# EAGLE design regulator_plus_switch (EAGLE 7.2.0)
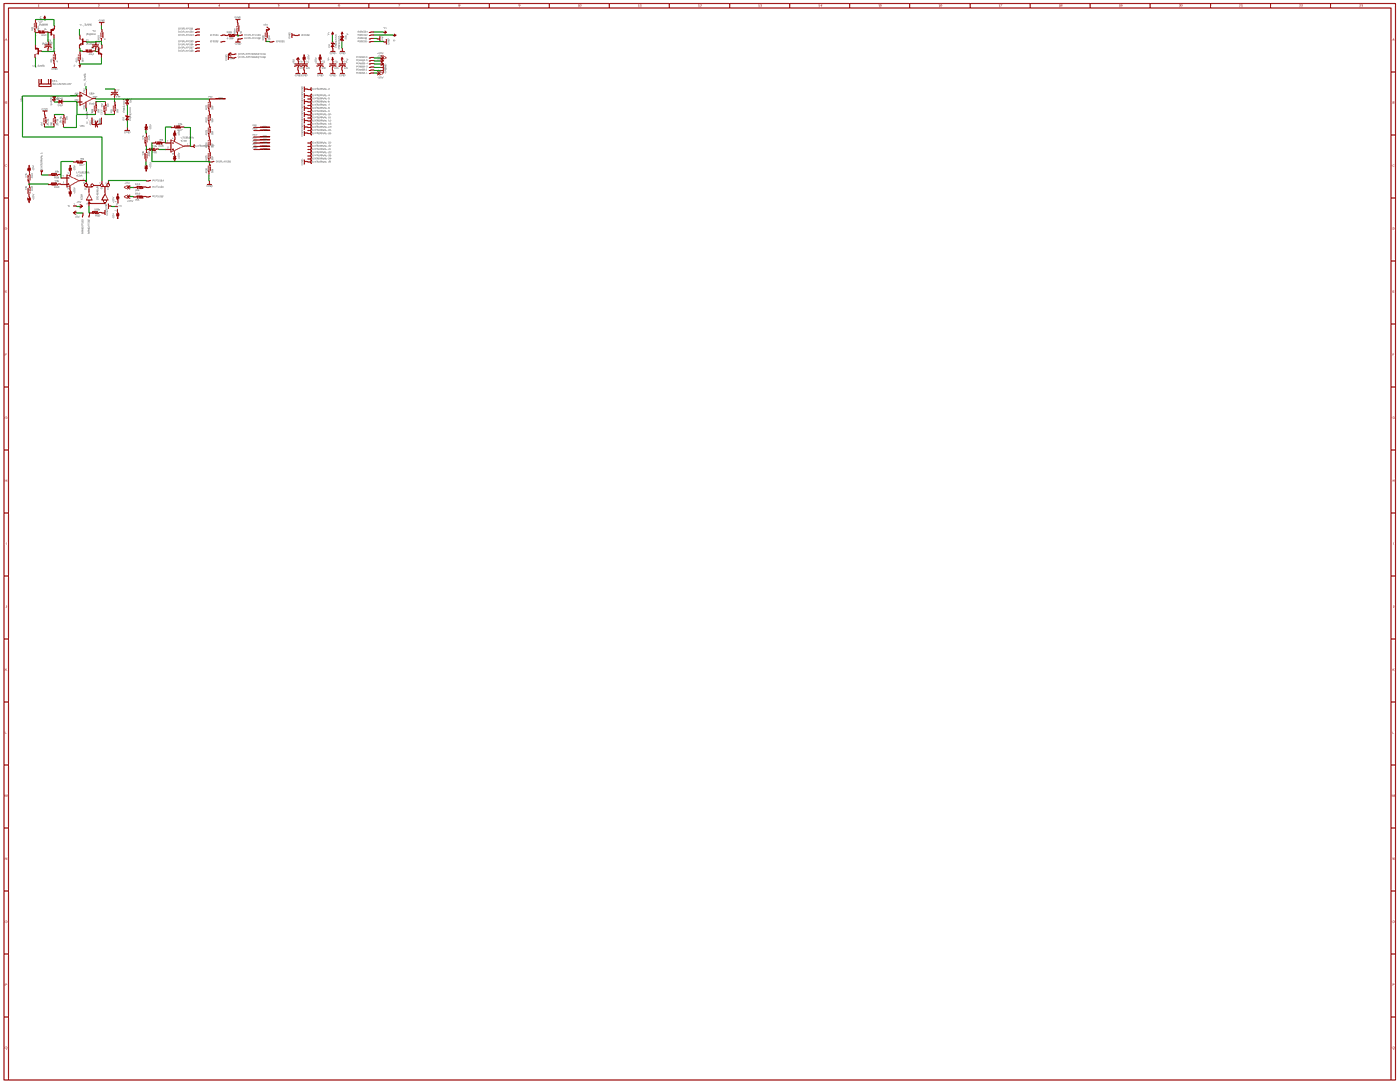
[diagram p0: schematic, sheet 1, overview]
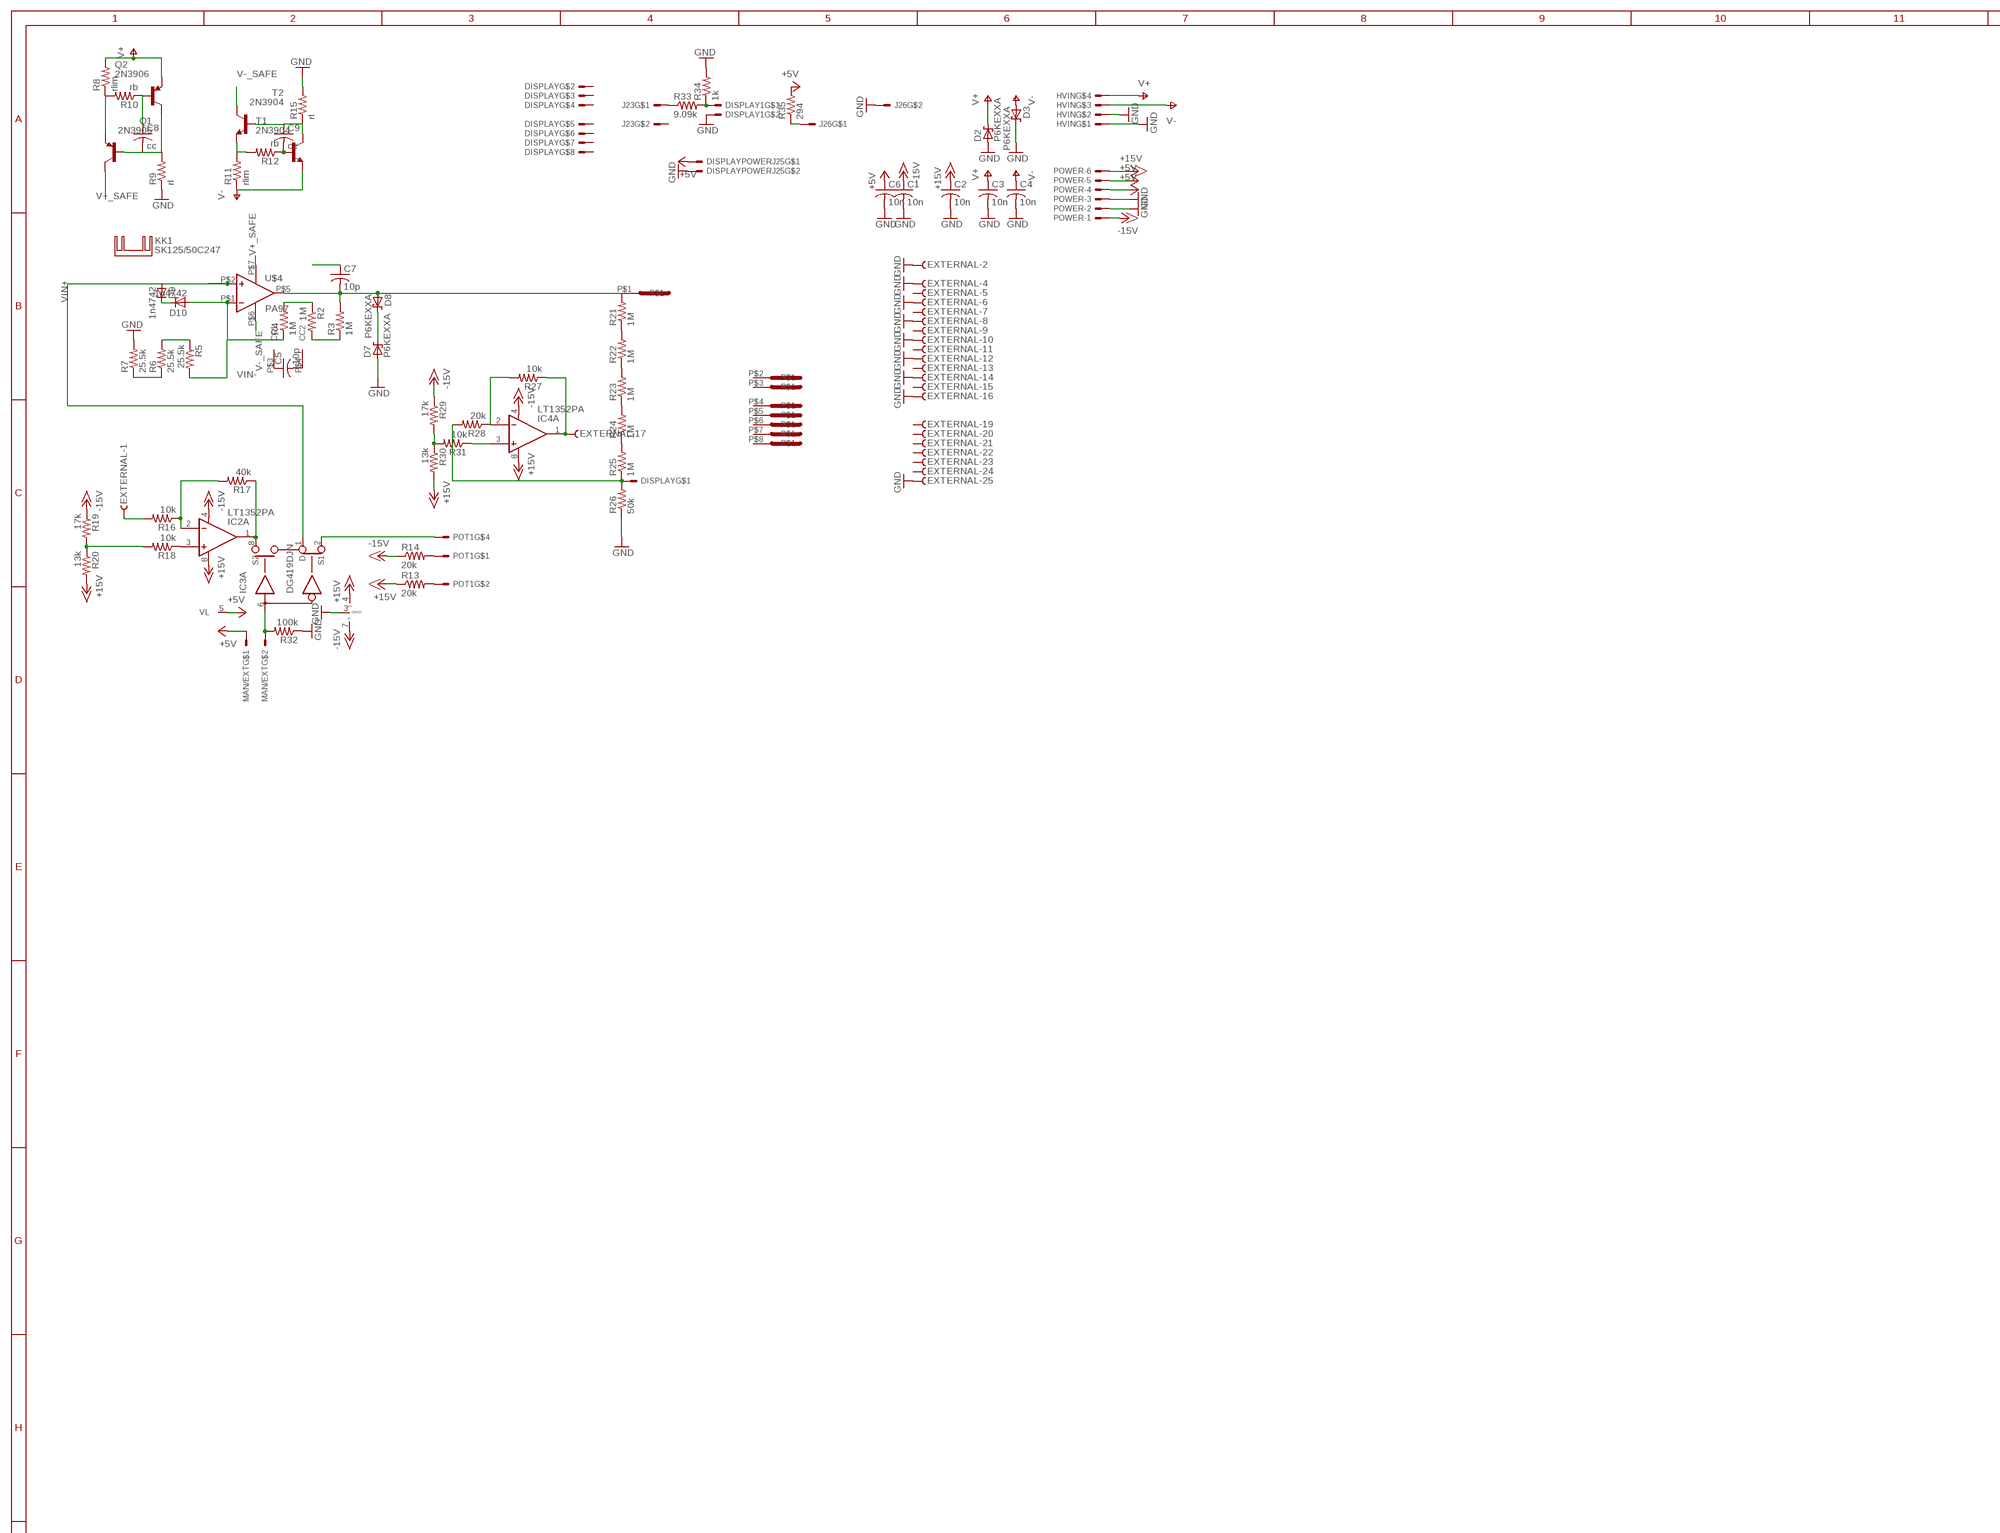
[diagram p1: schematic, sheet 1, part 1 of 5]
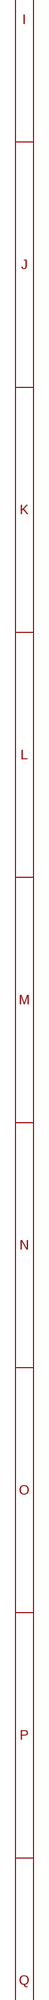
[diagram p2: schematic, sheet 1, part 2 of 5]
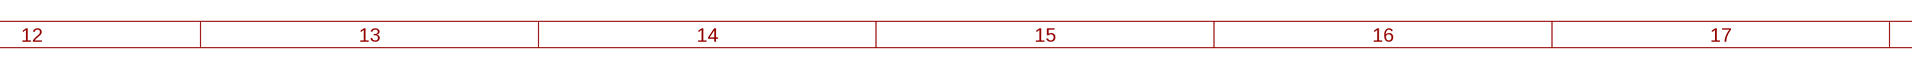
[diagram p3: schematic, sheet 1, part 3 of 5]
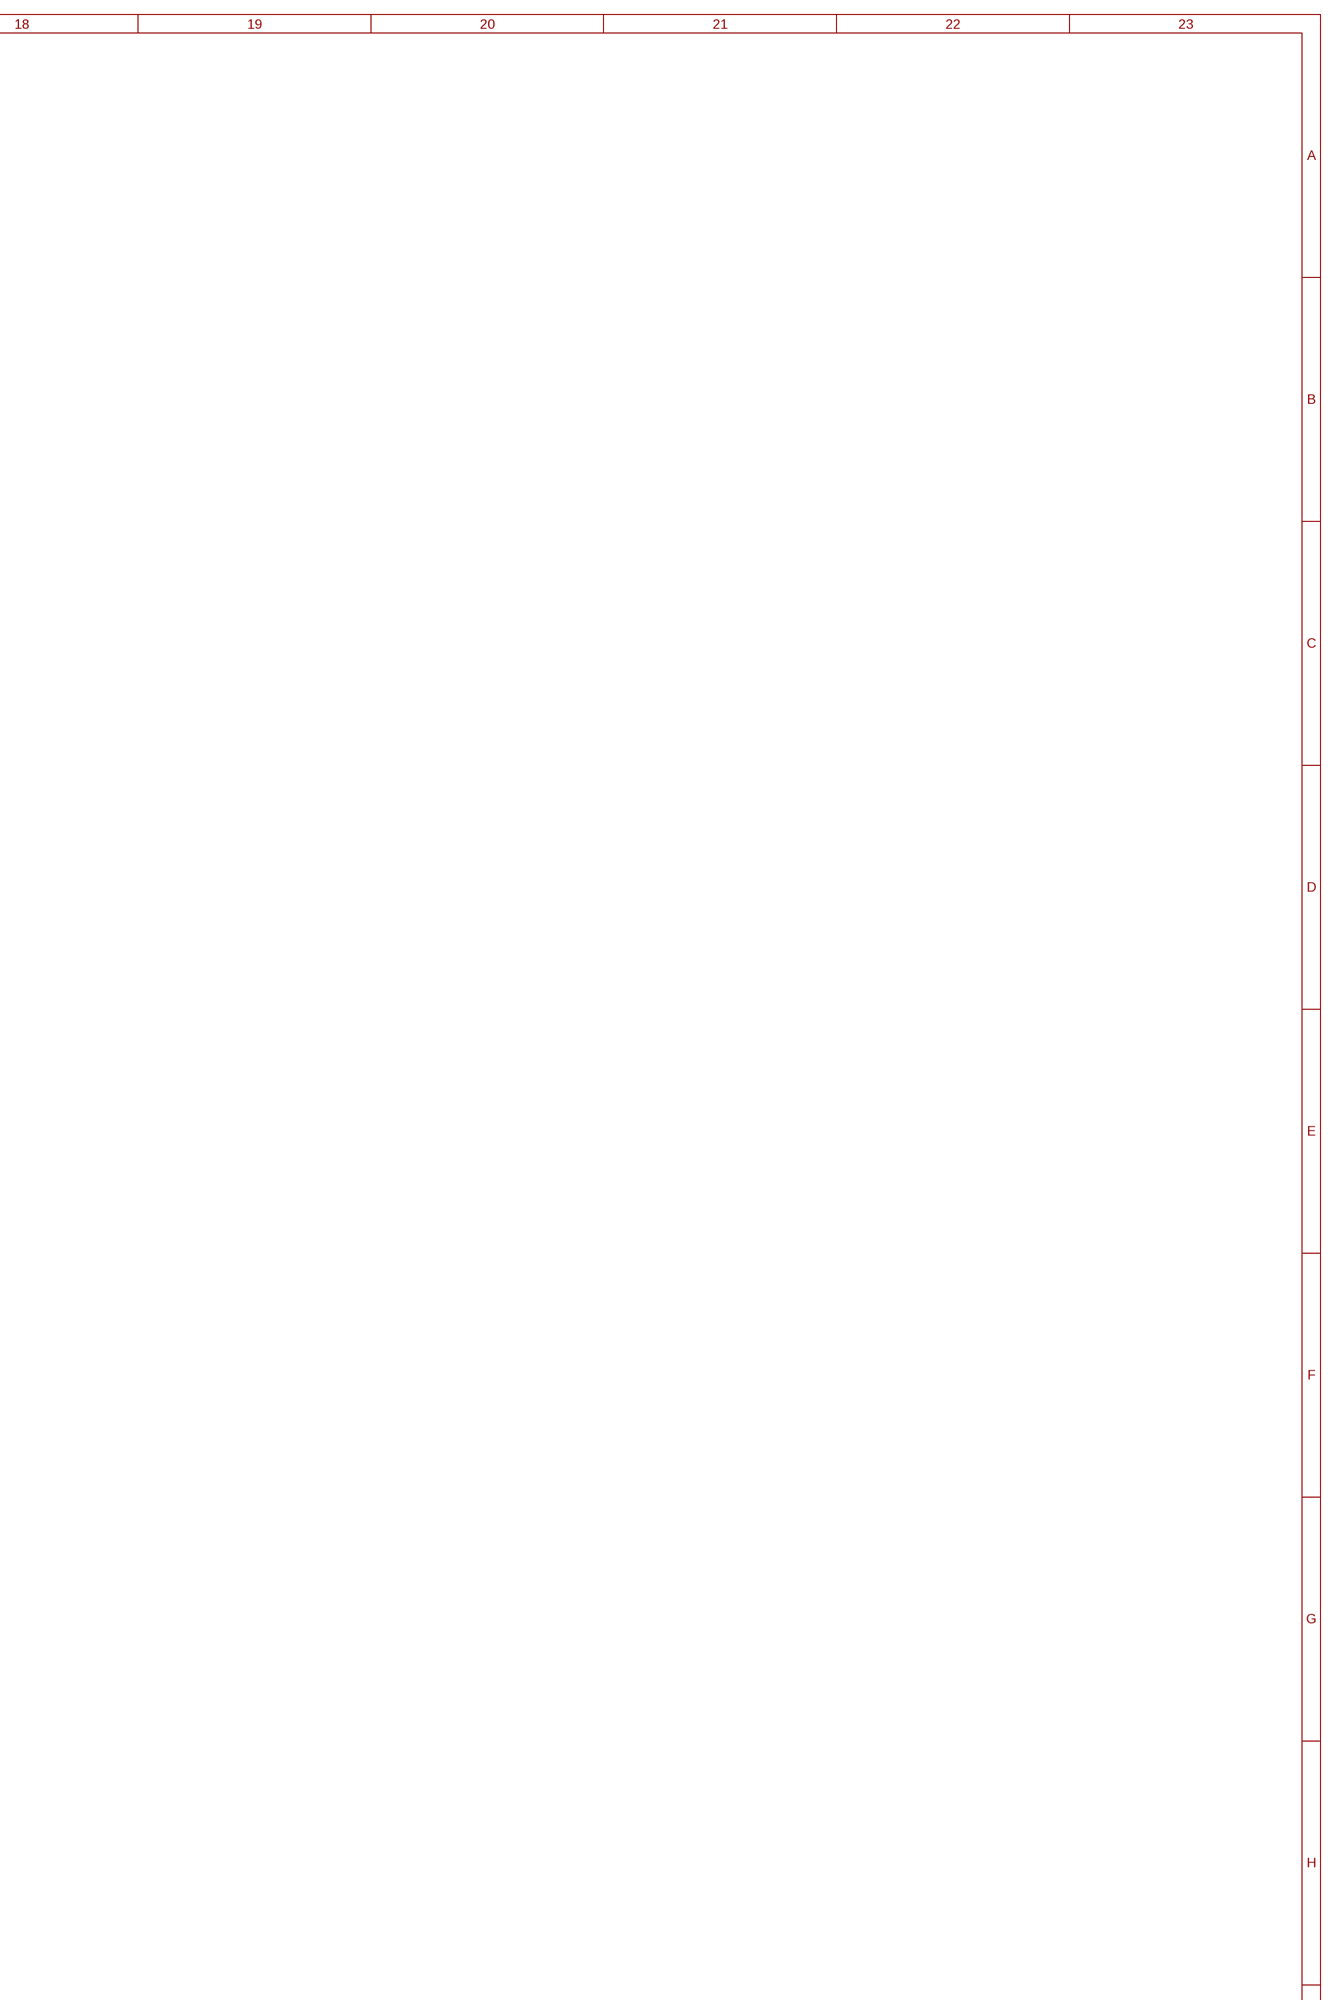
[diagram p4: schematic, sheet 1, part 4 of 5]
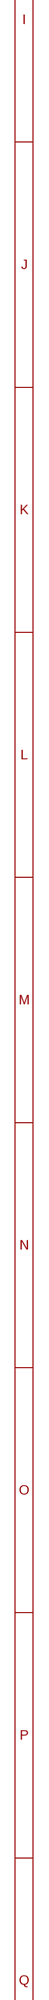
[diagram p5: schematic, sheet 1, part 5 of 5]

## Parts
C1  10n  C-US075-032X103  [C075-032X103]
C2  10n  C-US075-032X103  [C075-032X103]
C3  10n  C-US075-032X103  [C075-032X103]
C4  10n  C-US075-032X103  [C075-032X103]
C5  10p  C-US075-032X103  [C075-032X103]
C6  10n  C-US075-032X103  [C075-032X103]
C7  10p  C-US075-032X103  [C075-032X103]
C8  cc  C-US075-032X103  [C075-032X103]
C9  cc  C-US075-032X103  [C075-032X103]
D2  P6KEXXA  [C1702-15]
D3  P6KEXXA  [C1702-15]
D7  P6KEXXA  [C1702-15]
D8  P6KEXXA  [C1702-15]
D9  1n4742  ZENER-DIODEDO41Z10  [DO41Z10]
D10  1n4742  ZENER-DIODEDO41Z10  [DO41Z10]
DISPLAY  5669-8  [5669-8]
DISPLAY1  5569-2  [5569-2]
DISPLAYPOWERJ25  5569-2  [5569-2]
EXTERNAL  F25HPS  [F25HP]
HVIN  5569-4  [5669-4]
IC2  LT1352PA  [DIL08]
IC3  DG419DJN  [DIL08]
IC4  LT1352PA  [DIL08]
J23  5569-2  [5569-2]
J26  5569-2  [5569-2]
KK1  SK125/50C247  [C247-050]
MAN/EXT  5569-2  [5569-2]
OUT  640584-1  [640584-1]
POT1  5569-4  [5669-4]
POWER  KK-156-6  [KK-156-6]
Q1  2N3906  [TO92]
Q2  2N3906  [TO92]
R2  1M  R-US_0207/10  [0207/10]
R3  1M  R-US_0207/10  [0207/10]
R4  1M  R-US_0207/10  [0207/10]
R5  25.5k  R-US_0207/10  [0207/10]
R6  25.5k  R-US_0207/10  [0207/10]
R7  25.5k  R-US_0207/10  [0207/10]
R8  rlim  R-US_0207/10  [0207/10]
R9  rl  R-US_0207/10  [0207/10]
R10  rb  R-US_0207/10  [0207/10]
R11  rlim  R-US_0207/10  [0207/10]
R12  rb  R-US_0207/10  [0207/10]
R13  20k  R-US_0207/15  [0207/15]
R14  20k  R-US_0207/15  [0207/15]
R15  rl  R-US_0207/10  [0207/10]
R16  10k  R-US_0207/10  [0207/10]
R17  40k  R-US_0207/10  [0207/10]
R18  10k  R-US_0207/10  [0207/10]
R19  17k  R-US_0207/10  [0207/10]
R20  13k  R-US_0207/10  [0207/10]
R21  1M  R-US_0207/10  [0207/10]
R22  1M  R-US_0207/10  [0207/10]
R23  1M  R-US_0207/10  [0207/10]
R24  1M  R-US_0207/10  [0207/10]
R25  1M  R-US_0207/10  [0207/10]
R26  50k  R-US_0207/10  [0207/10]
R27  10k  R-US_0207/10  [0207/10]
R28  20k  R-US_0207/10  [0207/10]
R29  17k  R-US_0207/10  [0207/10]
R30  13k  R-US_0207/10  [0207/10]
R31  10k  R-US_0207/10  [0207/10]
R32  100k  R-US_0207/15  [0207/15]
R33  9.09k  R-US_0207/10  [0207/10]
R34  1k  R-US_0207/10  [0207/10]
R35  294  R-US_0207/10  [0207/10]
T1  2N3904  [TO92]
T2  2N3904  [TO92]
U$4  PA97  [7SIP]

## Nets
+5V: C6.1 DISPLAYPOWERJ25.P$1 IC3.5(VL:VL) MAN/EXT.P$1 POWER.4 POWER.5 R35.2
+15V: C2.1 IC2.8(A:V+) IC3.4(P:V+) IC4.8(A:V+) POWER.6 R13.1 R20.2 R30.2
-15V: C1.1 IC2.4(A:V-) IC3.7(P:V-) IC4.4(A:V-) POWER.1 R14.1 R19.1 R29.1
CMD1: EXTERNAL.1 R16.2
GND: C1.2 C2.2 C3.2 C4.2 C6.2 D2.A D3.C D7.A DISPLAY1.P$2 DISPLAYPOWERJ25.P$2 EXTERNAL.2 EXTERNAL.4 EXTERNAL.6 EXTERNAL.8 EXTERNAL.10 EXTERNAL.12 EXTERNAL.14 EXTERNAL.16 EXTERNAL.25 HVIN.P$1 HVIN.P$2 IC3.3(P:GND) J26.P$2 POWER.2 POWER.3 R7.2 R9.1 R15.2 R26.1 R32.1 R34.2
MAN: IC3.6(A:IN) MAN/EXT.P$2 R32.2
N$1: R11.2 R12.2 T2.3(E)
N$2: C8.1 Q2.2(B) R10.1
N$3: C5.1 U$4.P$3(CC1)
N$4: C5.2 U$4.P$4(CC2)
N$5: Q1.3(E) R8.1 R10.2
N$8: D7.C D8.C
N$9: POT1.P$2 R13.2
N$10: C8.2 Q1.2(B) Q2.1(C) R9.2
N$11: C7.2 D8.A OUT.P$1 R3.2 R21.2 U$4.P$5(OUT)
N$12: R2.1 R4.2
N$13: IC3.2(A:S1) POT1.P$4
N$14: R5.1 R6.2
N$15: POT1.P$1 R14.2
N$16: R6.1 R7.1
N$17: C9.2 R12.1 T1.2(B)
N$18: R2.2 R3.1
N$19: C9.1 R15.1 T1.1(C) T2.2(B)
N$20: DISPLAY1.P$1 R33.2 R34.1
N$21: J23.P$1 R33.1
N$22: J26.P$1 R35.1
N$24: IC2.2(A:-IN) R16.1 R17.2
N$25: IC2.3(A:+IN) R18.1
N$26: R18.2 R19.2 R20.1
N$27: IC2.1(A:OUT) IC3.8(A:S2) R17.1
N$29: D9.C D10.C
N$30: R21.1 R22.2
N$31: R22.1 R23.2
N$32: R23.1 R24.2
N$33: R24.1 R25.2
N$34: DISPLAY.P$1 R25.1 R26.2 R28.2
N$35: EXTERNAL.17 IC4.1(A:OUT) R27.1
N$36: R29.2 R30.1 R31.2
N$37: IC4.3(A:+IN) R31.1
N$39: IC4.2(A:-IN) R27.2 R28.1
V+: C3.1 D2.C HVIN.P$4 Q2.3(E) R8.2
V+_SAFE: Q1.1(C) U$4.P$7(V+)
V-: C4.1 D3.A HVIN.P$3 R11.1 T1.3(E)
V-_SAFE: T2.1(C) U$4.P$6(V-)
VIN+: D9.A IC3.1(A:D) U$4.P$2(+IN)
VIN-: C7.1 D10.A R4.1 R5.2 U$4.P$1(-IN)
Unconnected: DISPLAY.P$2 DISPLAY.P$3 DISPLAY.P$4 DISPLAY.P$5 DISPLAY.P$6 DISPLAY.P$7 DISPLAY.P$8 EXTERNAL.3 EXTERNAL.5 EXTERNAL.7 EXTERNAL.9 EXTERNAL.11 EXTERNAL.13 EXTERNAL.15 EXTERNAL.18 EXTERNAL.19 EXTERNAL.20 EXTERNAL.21 EXTERNAL.22 EXTERNAL.23 EXTERNAL.24 IC2.5(B:+IN) IC2.6(B:-IN) IC2.7(B:OUT) IC4.5(B:+IN) IC4.6(B:-IN) IC4.7(B:OUT) J23.P$2 OUT.P$2 OUT.P$3 OUT.P$4 OUT.P$5 OUT.P$6 OUT.P$7 OUT.P$8 POT1.P$3

## Library data of the parts
C1-C9 = rcl:C-US: CAPACITOR, American symbol
D2 D3 D7 D8 = diode:P6KEXXA: DIODE transient-voltage suppressor
D9 D10 = diode:ZENER-DIODE: Z-Diode
DISPLAY = con-molex:5669-8
DISPLAY1 DISPLAYPOWERJ25 J23 J26 MAN/EXT = con-molex:5569-2
EXTERNAL = con-subd:F25?S: SUB-D; OC_FARNELL: unknown; OC_NEWARK: unknown
HVIN POT1 = con-molex:5569-4
IC2 IC4 = linear-technology:LT1352: Dual Operational Amplifiers Source: http://datasheets.maxim-ic.com/en/ds/ICL7612-ICL764X.pdf; OC_FARNELL: unknown; OC_NEWARK: unknown
IC3 = linear:DG419DJ: CMOS SWITCH
KK1 = heatsink:SK125/50: HEATSINK manufacturer Fischer/distributor Buerklin
OUT = con-amp-te:640584-1
POWER = con-molex:KK-156-6: KK 156 HEADER Source: http://www.molex.com/pdm_docs/sd/026604100_sd.pdf; OC_FARNELL: unknown; OC_NEWARK: unknown
Q1 Q2 = transistor-pnp:2N3906: PNP Transistor
R2-R20 R26-R35 = rcl:R-US_: RESISTOR, American symbol
R21-R25 = resistor:R-US_: RESISTOR, American symbol
T1 T2 = transistor:2N3904: NPN TRANSISTOR
U$4 = apex:PA97

## Board
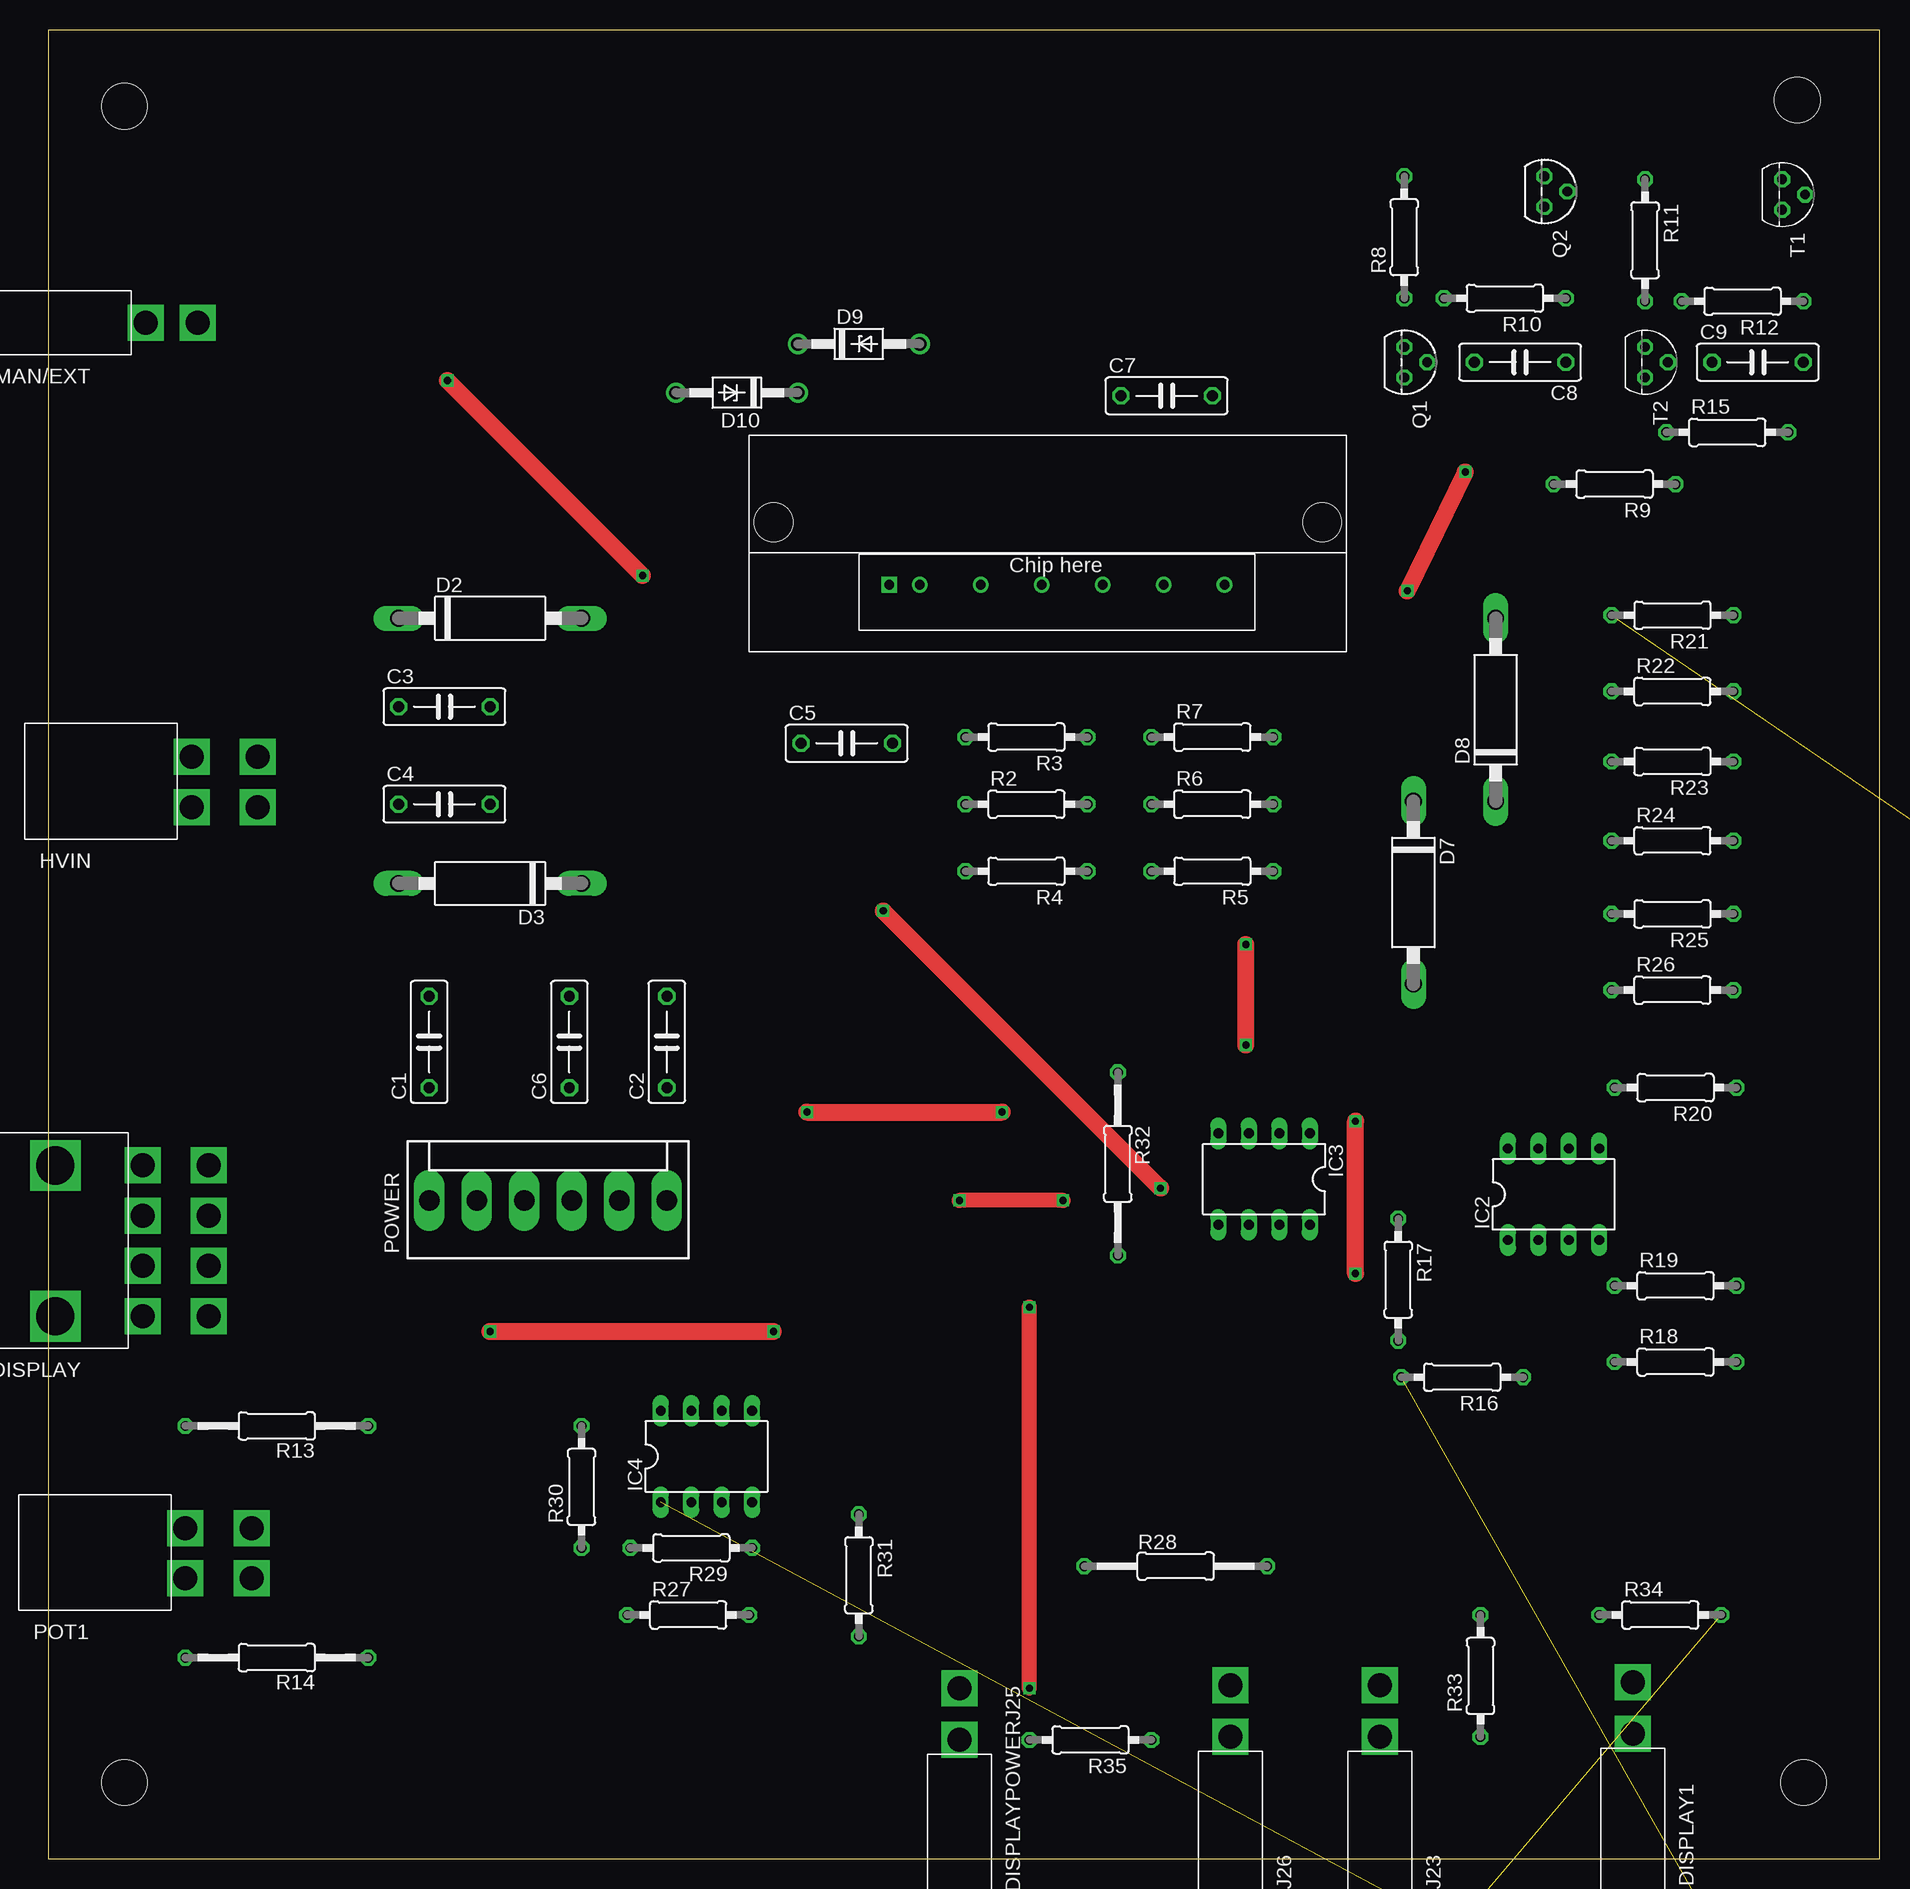
[diagram p6: board, top side]
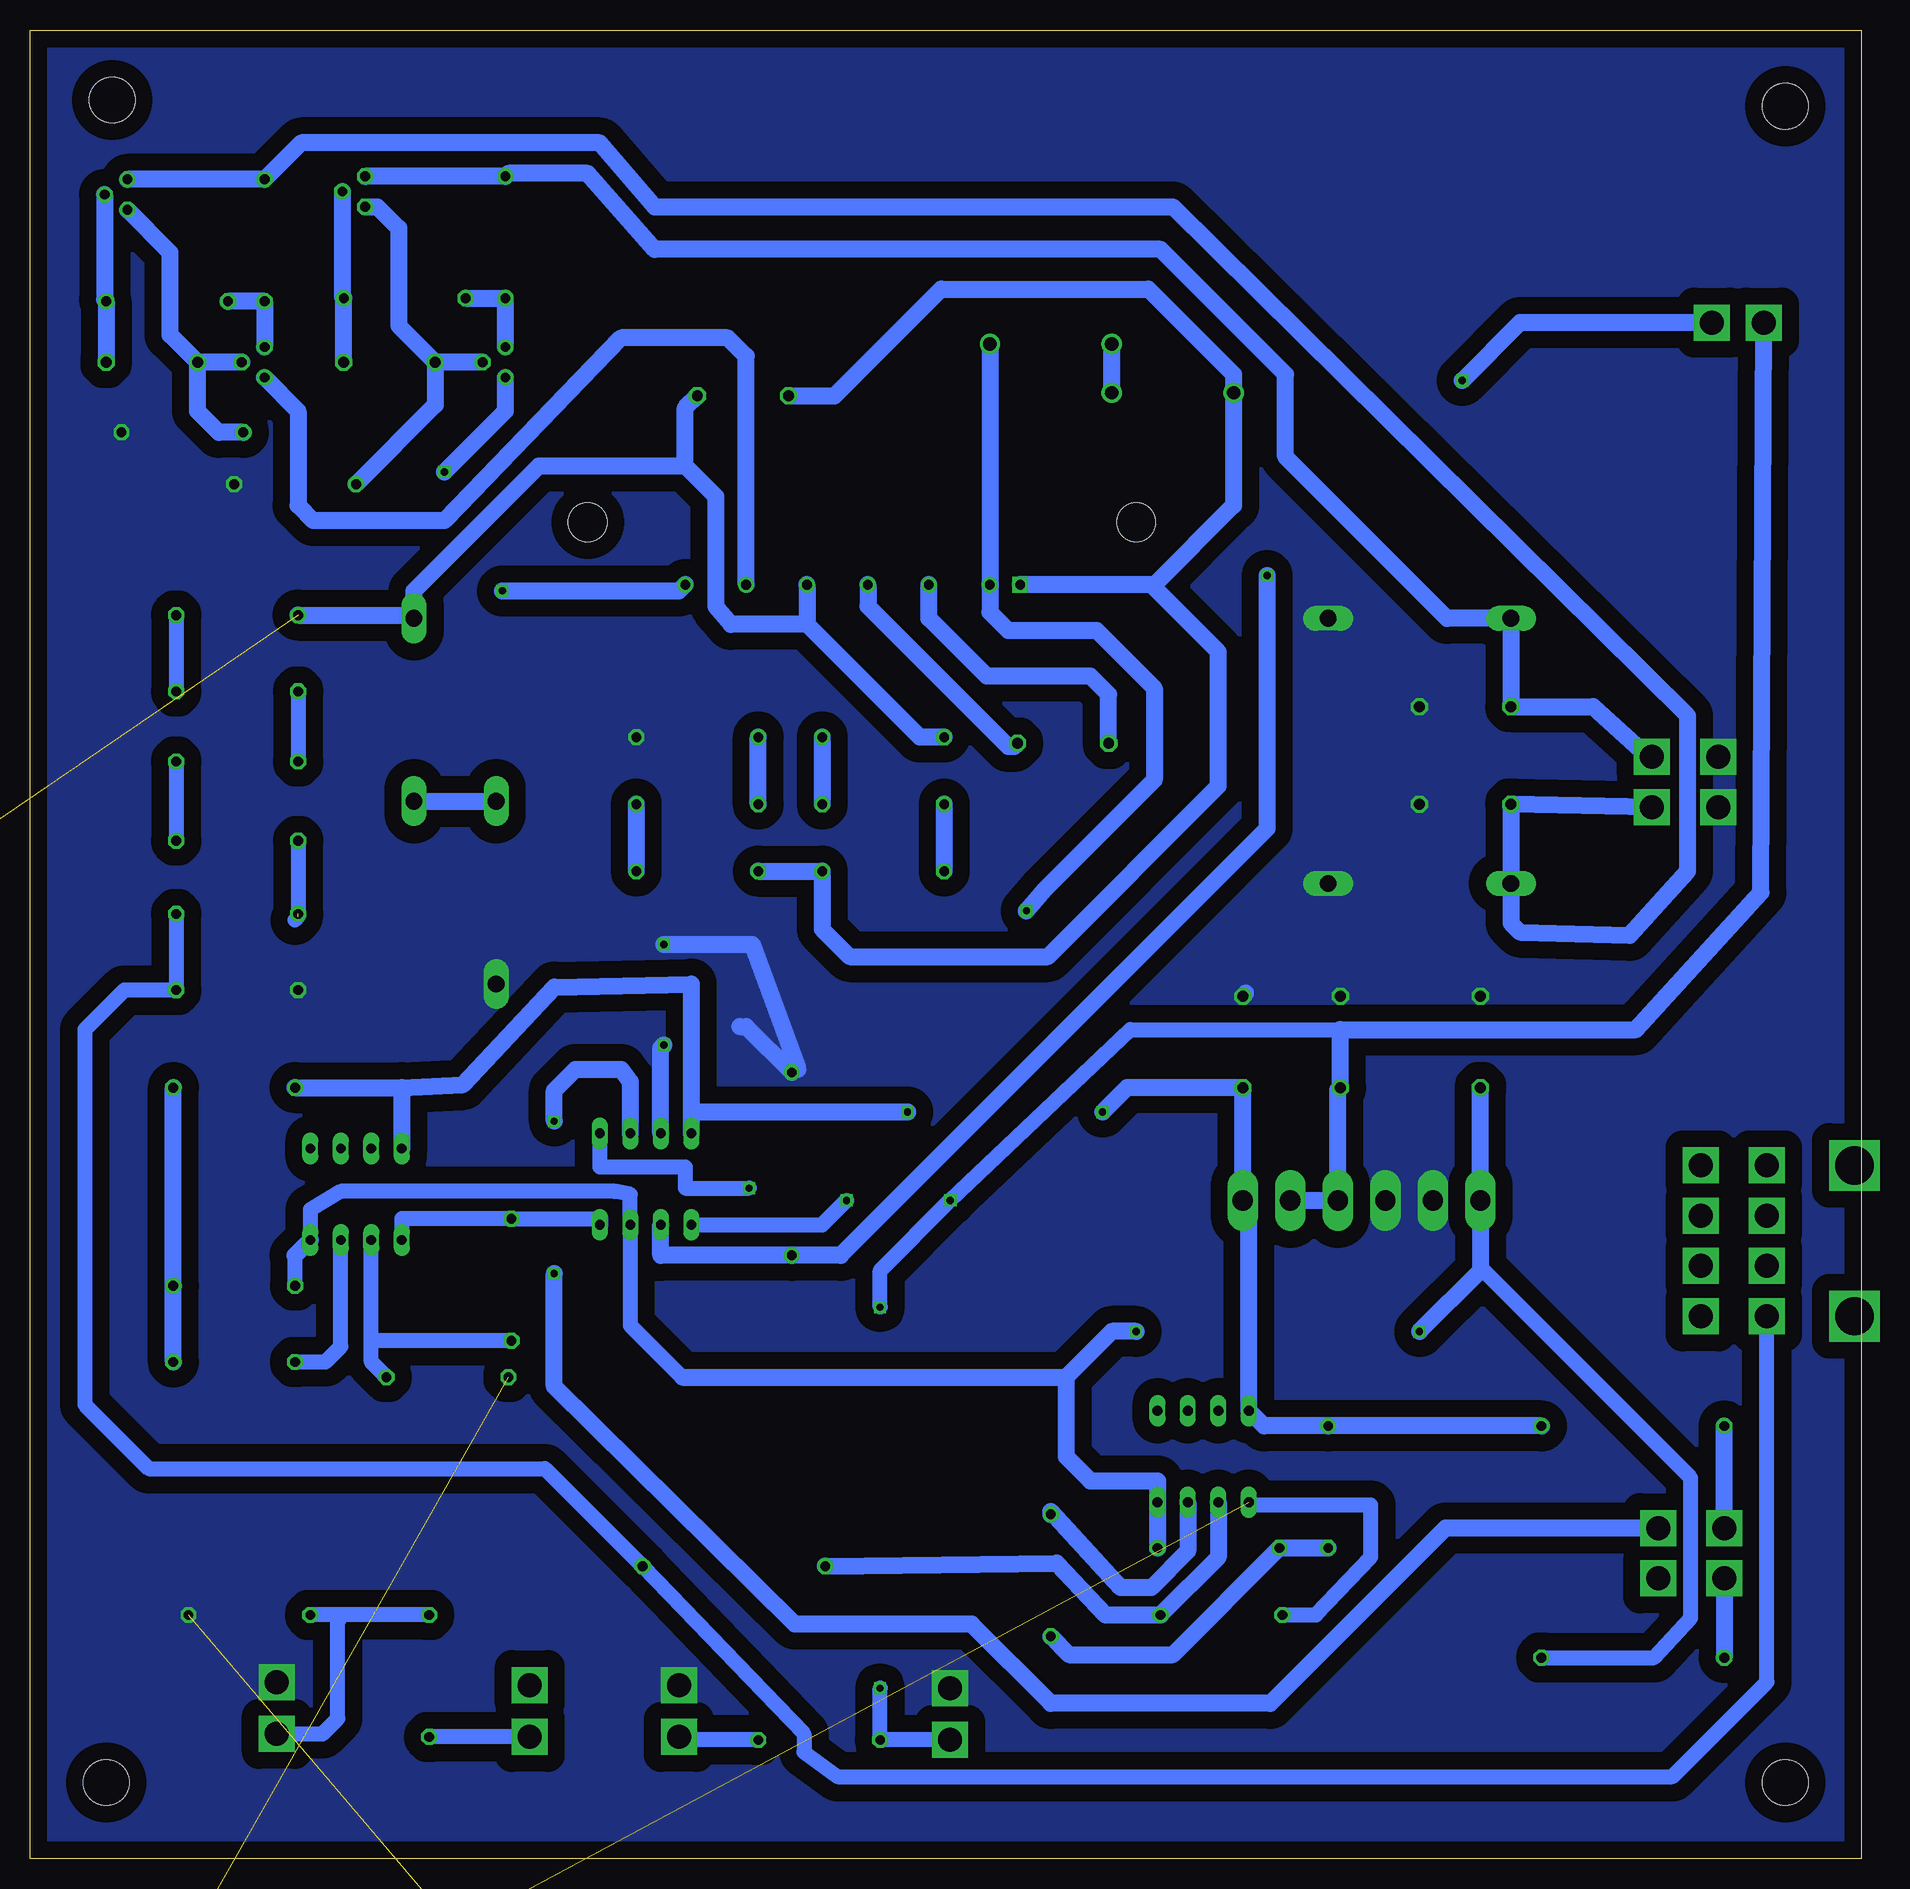
[diagram p7: board, bottom side, seen from below]

Size 152.65 x 152.4 mm. Coordinates in mm from the lower left corner, seen from the top.
Outline: 0,0 152.65,0 152.65,152.4 0,152.4 0,0
Copper layers (1*16): Top 0.035mm / dielectric 1.5mm / Bottom 0.035mm
Design rules "default": minimum track width 10mil, minimum drill 24mil, track to track 8mil, track to pad 8mil, pad to pad 8mil, via to via 8mil, smd to smd 8mil, copper to edge 40mil, drill to drill 8mil, minimum pad ring 10mil, minimum via ring 8mil, stop-mask expansion 4mil, vias tented up to drill 0mil, thermal gap 10mil
Holes 3.8 mm at 6.35,146.05 145.8,146.56 146.3,6.35 6.35,6.35

### Footprints (pad centres in the part's own frame; a part is rotated, then mirrored left to right if it is on the bottom)
C075-032X103 = drill 0.914 octagon: 1 -3.81,0; 2 3.81,0
C1702-15 = drill 1.397 long: A 7.62,0; C -7.62,0
DO41Z10 = drill 1.118: A 5.08,0; C -5.08,0
5669-8 = drill 2 square: P$1 0,0; P$2 -4.191,0; P$3 -8.382,0; P$4 -12.573,0; P$5 0,5.512; P$6 -4.191,5.512; P$7 -8.382,5.512; P$8 -12.573,5.512 | drill 3.2 square: P$9 0,-7.29; P$10 -12.573,-7.29
5569-2 = drill 2 square: P$1 0,0; P$2 0,4.318
F25HP = drill 1.016 octagon: 1 -16.561,-1.27; 2 -13.792,-1.27; 3 -11.049,-1.27; 4 -8.28,-1.27; 5 -5.512,-1.27; 6 -2.769,-1.27; 7 0,-1.27; 8 2.769,-1.27; 9 5.512,-1.27; 10 8.28,-1.27; 11 11.049,-1.27; 12 13.792,-1.27; 13 16.561,-1.27; 14 -15.189,1.27; 15 -12.421,1.27; 16 -9.652,1.27; 17 -6.909,1.27; 18 -4.14,1.27; 19 -1.372,1.27; 20 1.372,1.27; 21 4.14,1.27; 22 6.909,1.27; 23 9.652,1.27; 24 12.421,1.27; 25 15.189,1.27 | drill 3.302 pad 5.08: G1 -23.52,0; G2 23.52,0
5669-4 = drill 2 square: P$1 0,0; P$2 -4.191,0; P$3 0,5.512; P$4 -4.191,5.512
DIL08 = drill 0.813 long: 1 -3.81,-3.81; 2 -1.27,-3.81; 3 1.27,-3.81; 4 3.81,-3.81; 5 3.81,3.81; 6 1.27,3.81; 7 -1.27,3.81; 8 -3.81,3.81
C247-050 = hole 3.2: 2.032,7.239; 47.752,7.239
640584-1 = drill 1.5 square: P$1 0,0 | drill 1.5: P$2 6.35,0; P$3 12.7,0; P$4 19.05,0; P$5 25.4,0; P$6 31.75,0; P$7 38.1,0; P$8 44.45,0 | hole 3.81: -7.62,2.54; 52.07,2.54
KK-156-6 = drill 1.7 pad 2.184 long: 1 -9.9,0; 2 -5.94,0; 3 -1.98,0; 4 1.98,0; 5 5.94,0; 6 9.9,0
TO92 = drill 0.813 octagon: 1 1.27,0; 2 0,1.905; 3 -1.27,0
0207/10 = drill 0.813 octagon: 1 -5.08,0; 2 5.08,0
0207/15 = drill 0.813 octagon: 1 -7.62,0; 2 7.62,0
7SIP = drill 0.8 square: P$1 0,0 | drill 0.8: P$2 2.54,0; P$3 7.62,0; P$4 12.7,0; P$5 17.78,0; P$6 22.86,0; P$7 27.94,0

### Placement (x,y rotation side)
C1  31.75,68.07 90 top
C2  51.56,68.07 90 top
C3  33.02,96.01 0 top
C4  33.02,87.88 0 top
C5  66.55,92.96 0 top
C6  43.43,68.07 90 top
C7  93.22,121.92 0 top
C8  122.68,124.71 180 top
C9  142.49,124.71 0 top
D2  36.83,103.38 0 top
D3  36.83,81.28 180 top
D7  113.79,80.52 270 top
D8  120.65,95.76 90 top
D9  67.56,126.24 0 top
D10  57.4,122.17 180 top
DISPLAY  7.87,45.21 270 top
DISPLAY1  132.08,10.41 0 top
DISPLAYPOWERJ25  75.95,9.91 0 top
EXTERNAL  125.48,-12.7 180 top  (outside the outline)
HVIN  11.94,87.63 270 top
IC2  125.48,55.37 0 top
IC3  101.35,56.64 180 top
IC4  54.86,33.53 0 top
J23  111,10.16 0 top
J26  98.55,10.16 0 top
KK1  108.2,118.62 180 top
MAN/EXT  8.13,128.02 270 top
OUT  168.66,77.47 270 top  (outside the outline)
POT1  11.43,23.37 270 top
POWER  41.66,54.86 0 top
Q1  113.03,124.71 270 top
Q2  124.71,138.94 270 top
R2  81.53,87.88 0 top
R3  81.53,93.47 180 top
R4  81.53,82.3 180 top
R5  97.03,82.3 180 top
R6  97.03,87.88 0 top
R7  97.03,93.47 0 top
R8  113.03,135.13 90 top
R9  130.56,114.55 180 top
R10  121.41,130.05 180 top
R11  133.1,134.87 270 top
R12  141.22,129.79 180 top
R13  19.05,36.07 180 top
R14  19.05,16.76 180 top
R15  139.95,118.87 0 top
R16  117.86,40.13 180 top
R17  112.52,48.26 270 top
R18  135.64,41.4 0 top
R19  135.64,47.75 0 top
R20  135.64,64.26 180 top
R21  135.38,103.63 180 top
R22  135.38,97.28 0 top
R23  135.38,91.44 180 top
R24  135.38,84.84 0 top
R25  135.38,78.74 180 top
R26  135.38,72.39 0 top
R27  53.34,20.32 0 top
R28  20k  [0207/15]  93.98,24.38 0 top
R29  53.59,25.91 180 top
R30  44.45,30.99 90 top
R31  67.56,23.62 270 top
R32  89.15,57.91 270 top
R33  119.38,15.24 90 top
R34  134.37,20.32 0 top
R35  86.87,9.91 180 top
T1  144.53,138.68 270 top
T2  133.1,124.71 270 top
U$4  70.1,106.17 0 top

### Tracks (layer width: path | path; a pad name or v marks a point on that pad's centre or on a via)
+5V  (via drill 0.6)
  Top 1.27: v84.58,54.86 v75.95,54.86 | v81.79,14.22 v81.79,45.97
  Bottom 1.27: DISPLAYPOWERJ25.P$1 R35.2 v81.79,14.22 | IC3.5 86.61,52.83 v84.58,54.86 | 43.43,69.09 60.96,69.09 v75.95,54.86 81.79,49.02 v81.79,45.97 | 47.5,54.77 POWER.5
  Bottom 1.422: POWER.5 POWER.4 43.64,64.06 C6.1 43.43,69.09 18.8,69.09 8.38,80.52 MAN/EXT.P$1
+15V  (via drill 0.6)
  Top 1.422: v63.25,62.23 v79.5,62.23
  Bottom 1.422: R20.2 121.67,64.26 | 121.67,64.26 IC2.8 | 121.67,64.26 116.59,64.52 108.97,72.64 97.54,72.9 97.54,62.23 | 97.54,62.23 IC3.4 | v79.5,62.23 97.54,62.23 | R13.1 R30.2 49.78,36.07 IC4.8 51.05,54.36 POWER.6 C2.1 61.21,64.26 v63.25,62.23
-15V  (via drill 0.6)
  Top 1.422: v36.83,43.94 v60.45,43.94
  Bottom 1.27: R19.1 130.56,50.29 | IC2.4 129.29,54.1 126.75,55.63 103.89,55.63 102.62,55.37 IC3.7 102.62,44.45 98.3,40.13 | R14.1 17.27,16.76 14.22,20.07 14.22,31.74 31.76,49.28
  Bottom 1.422: 130.56,50.29 IC2.4 | R29.1 IC4.4 58.67,31.5 64.26,31.5 66.29,33.53 66.29,40.13 | C1.1 POWER.1 31.76,49.28 31.76,49.02 v36.83,43.94 | v60.45,43.94 62.48,43.94 66.29,40.13 | 98.3,40.13 66.29,40.13
CMD1  (1 unrouted)
GND  (via drill 0.6)  (9 unrouted)
  Top 1.422: v99.82,67.82 v99.82,76.2
  Bottom 1.422: 51.31,72.14 C2.2 | 93.47,69.34 92.96,69.34 R32.1 | IC3.3 100.08,67.56 v99.82,67.82 | v99.82,76.2 92.46,76.2 88.65,65.79
  pour Bottom (isolate 1.422, no thermals): 0,0 152.65,0 152.65,152.4 0,152.4
MAN  (via drill 0.6)
  Top 1.422: v33.27,123.19 v49.53,106.93
  Bottom 1.422: IC3.6 100.08,50.29 R32.2 85.09,50.29 49.53,85.85 v49.53,106.93 | MAN/EXT.P$2 28.45,128.02 v33.27,123.19
N$1
  Bottom 1.422: R12.2 R11.2 T2.3
N$2
  Bottom 1.422: Q2.2 126.62,130.18 R10.1 C8.1
N$3
  Bottom 1.422: C5.1 62.74,97.03 64.26,98.55 72.9,98.55 77.72,103.38 U$4.P$3
N$4
  Bottom 1.422: U$4.P$4 82.8,104.39 71.12,92.71 70.61,92.71 C5.2
N$5
  Bottom 1.422: R10.2 R8.1 Q1.3
N$8
  Bottom 1.422: D8.C D7.C
N$9
  Bottom 1.422: POT1.P$2 R13.2
N$10
  Bottom 1.422: Q2.1 123.7,137.67 121.92,135.89 121.92,127.76 C8.2 | Q1.2 C8.2 | C8.2 118.87,121.16 R9.2
N$11  (1 unrouted)
  Bottom 1.422: R3.2 78.49,93.47 87.88,102.87 | U$4.P$5 87.88,102.87 | 87.88,102.87 94.23,102.87 95.5,104.39 95.5,113.54 98.04,116.08 | R21.2 121.41,103.63 D8.A 120.65,105.66 110.24,116.08 98.04,116.08 | 98.04,116.08 98.04,120.9 C7.2
N$12
  Bottom 1.422: R2.1 R4.2
N$13  (via drill 0.6)
  Top 1.422: v108.97,48.77 v108.97,61.47
  Bottom 1.422: POT1.P$4 34.67,27.56 49.28,12.95 67.56,12.95 74.17,19.56 88.9,19.56 108.97,39.37 v108.97,48.77 | v108.97,61.47 108.97,64.01 107.19,65.79 103.38,65.79 102.62,64.77 IC3.2
N$14
  Bottom 1.422: R5.1 R6.2
N$15
  Bottom 1.422: POT1.P$1 R14.2
N$16
  Bottom 1.422: R6.1 R7.1
N$17
  Bottom 1.422: T1.2 146.43,129.92 R12.1 C9.2
N$18
  Bottom 1.422: R3.1 R2.2
N$19
  Bottom 1.422: T2.2 C9.1 | C9.1 140.97,127 140.97,133.86 T1.1 | R15.1 136.91,118.87 138.68,120.65 C9.1
N$20
  Bottom 1.27: R33.2 126.49,20.32 | 126.49,20.32 R34.1 | DISPLAY1.P$1 128.27,10.41 127,11.68 127,19.81 126.49,20.32
N$21
  Bottom 1.27: J23.P$1 R33.1
N$22
  Bottom 1.27: R35.1 98.3,9.91 J26.P$1
N$24
  Bottom 1.27: R16.1 124.21,41.4 124.21,43.18 | 124.21,43.18 IC2.2 | R17.2 124.21,43.18
N$25
  Bottom 1.27: R18.1 128.02,41.4 126.75,42.67 IC2.3
N$26
  Bottom 1.422: R20.1 R19.2 R18.2
N$27
  Bottom 1.27: IC2.1 121.67,53.34 R17.1 105.16,53.34
  Bottom 1.422: 105.16,53.34 IC3.8
N$29
  Bottom 1.422: D10.C D9.C
N$30
  Bottom 1.27: R21.1 R22.2
N$31
  Bottom 1.27: R22.1 R23.2
N$32
  Bottom 1.27: R23.1 R24.2
N$33  (1 unrouted)
  Bottom 1.27: R24.1 130.3,78.49 130.56,78.23
N$34
  Bottom 1.27: R25.1 R26.2 144.78,72.39 148.08,69.09 148.08,37.85 142.75,32.51 109.73,32.51 R28.2 88.14,10.41 88.14,8.89 85.34,6.86 15.75,6.86 7.87,14.73 DISPLAY.P$1
N$35  (1 unrouted)
  Bottom 1.27: R27.1 45.47,20.32 40.89,25.15 40.89,29.46 50.8,29.46 IC4.1
N$36
  Bottom 1.422: R30.1 R29.2 57.4,17.02 66.04,17.02 R31.2
N$37
  Bottom 1.422: IC4.3 56.13,25.65 59.18,22.61 61.72,22.61 67.56,28.96 R31.1
N$39
  Bottom 1.422: R28.1 67.06,24.64 62.99,20.32 R27.2 53.59,25.15 IC4.2
V+
  Bottom 1.422: Q2.3 R8.2 112.78,140.46 106.17,140.46 100.58,134.11 58.42,134.11 48.01,123.7 48.01,116.84 34.54,103.38 D2.C C3.1 22.35,96.01 17.02,91.19 17.02,91.39 HVIN.P$4
V+_SAFE  (via drill 0.6)
  Top 1.422: v118.11,115.57 v113.28,105.66
  Bottom 1.422: Q1.1 113.03,120.65 v118.11,115.57 | v113.28,105.66 98.55,105.66 U$4.P$7
V-
  Bottom 1.422: T1.3 R11.1 130.05,143 105.16,143 100.58,137.67 57.4,137.67 14.48,95.25 14.48,82.3 19.3,76.96 28.45,77.22 29.21,77.98 C4.1 | HVIN.P$3 C4.1 | C4.1 D3.A
V-_SAFE
  Bottom 1.422: U$4.P$6 92.96,125.22 94.49,126.75 103.38,126.75 118.11,111.51 129.03,111.51 130.3,112.78 130.3,120.65 T2.1
VIN+  (via drill 0.6)
  Top 1.422: v92.71,55.88 v69.6,78.99
  Bottom 1.27: IC3.1 105.16,57.66 98.04,57.66 98.04,55.88 v92.71,55.88
  Bottom 1.422: D9.A U$4.P$2 72.64,103.89 71.12,102.36 63.75,102.36 58.93,97.54 58.93,89.92 68.07,80.77 v69.6,78.99
VIN-
  Bottom 1.422: 59.18,106.17 58.93,106.17 52.32,112.78 D10.A 52.32,123.7 59.44,130.81 76.71,130.81 85.6,121.92 C7.1 | 59.18,106.17 U$4.P$1 | R5.2 R4.1 86.61,77.47 84.33,75.18 67.82,75.18 53.59,89.41 53.59,100.58 59.18,106.17